# Altium schematic sheet RELAY_12VV_VDD_LEVEL.SchDoc
size 149 x 149 mm; SheetNumber: 7; SheetTotal: 13
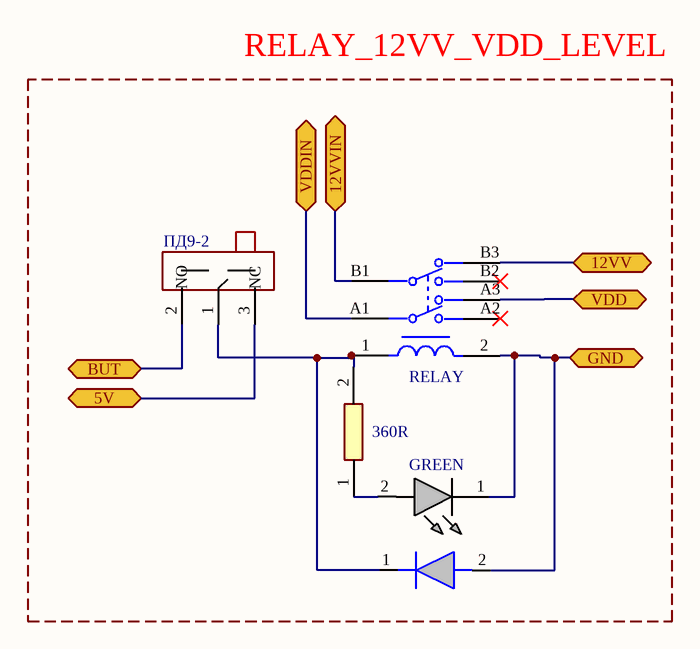
[diagram p0: RELAY_12VV_VDD_LEVEL.SchDoc]

## Parts
DIODRELE1  DIOD0805  [DIOD0805]  (value not drawn)
LEDRELE1  GREEN  [LED0805]
RELAY1  RELAY  [RELAY-5V]
RESRELE1  360R  [RES0805]
ПД9-2RELE2  ПД9-2  [ПД9-2]

## Blocks framed on the sheet
RELAY_12VV_VDD_LEVEL: DIODRELE1 LEDRELE1 RELAY1 RESRELE1 ПД9-2RELE2

## Ports
5V (bidir, see CONTROL_PCB_MAIN[2B]), 12VV (bidir, see CONTROL_PCB_MAIN[2B]), 12VVIN (bidir, see CONTROL_PCB_MAIN[3B], I_O[1A]), BUT (bidir, see CONTROL_PCB_MAIN[2B]), GND (bidir, see CONTROL_PCB_MAIN[2B], ADC1[2D], CAN[2C], I2C[2D], I_O[1C], LEDS[1D], MOTORS[2D], RELAY_5V_3.3V_LEVEL[5C], SPI[1D], STM32[1D], UARTSTM[2D]), VDD (bidir, see CONTROL_PCB_MAIN[2B]), VDDIN (bidir, see CONTROL_PCB_MAIN[3B], I_O[1A])

## Nets
5V: ПД9-2RELE2.3(NC) ; port 5V
12VV: RELAY1.B3 ; port 12VV
12VVIN: RELAY1.B1 ; port 12VVIN
BUT: ПД9-2RELE2.2(NO) ; port BUT
GND: DIODRELE1.2(A) LEDRELE1.1(K) RELAY1.2(A2) ; port GND
VDD: RELAY1.A3 ; port VDD
VDDIN: RELAY1.A1 ; port VDDIN
NetDIODRELE1_1: DIODRELE1.1(K) RELAY1.1(A1) RESRELE1.2 ПД9-2RELE2.1(COM)
NetLEDRELE1_2: LEDRELE1.2(A) RESRELE1.1

Not connected (* = marked no-connect by the designer): RELAY1 A2(14)* B2(24)*

## Library data of the parts
DIODRELE1 = DIOD0805: 1N4448WS-7-F
LEDRELE1 = LED0805: LED-SMD0805
RELAY1 = RELAY-5V: R2G2CH005
RESRELE1 = RES0805: RES-SMD0805